# EAGLE schematic EncoderPCB_V1_2 (EAGLE 9.6.2)
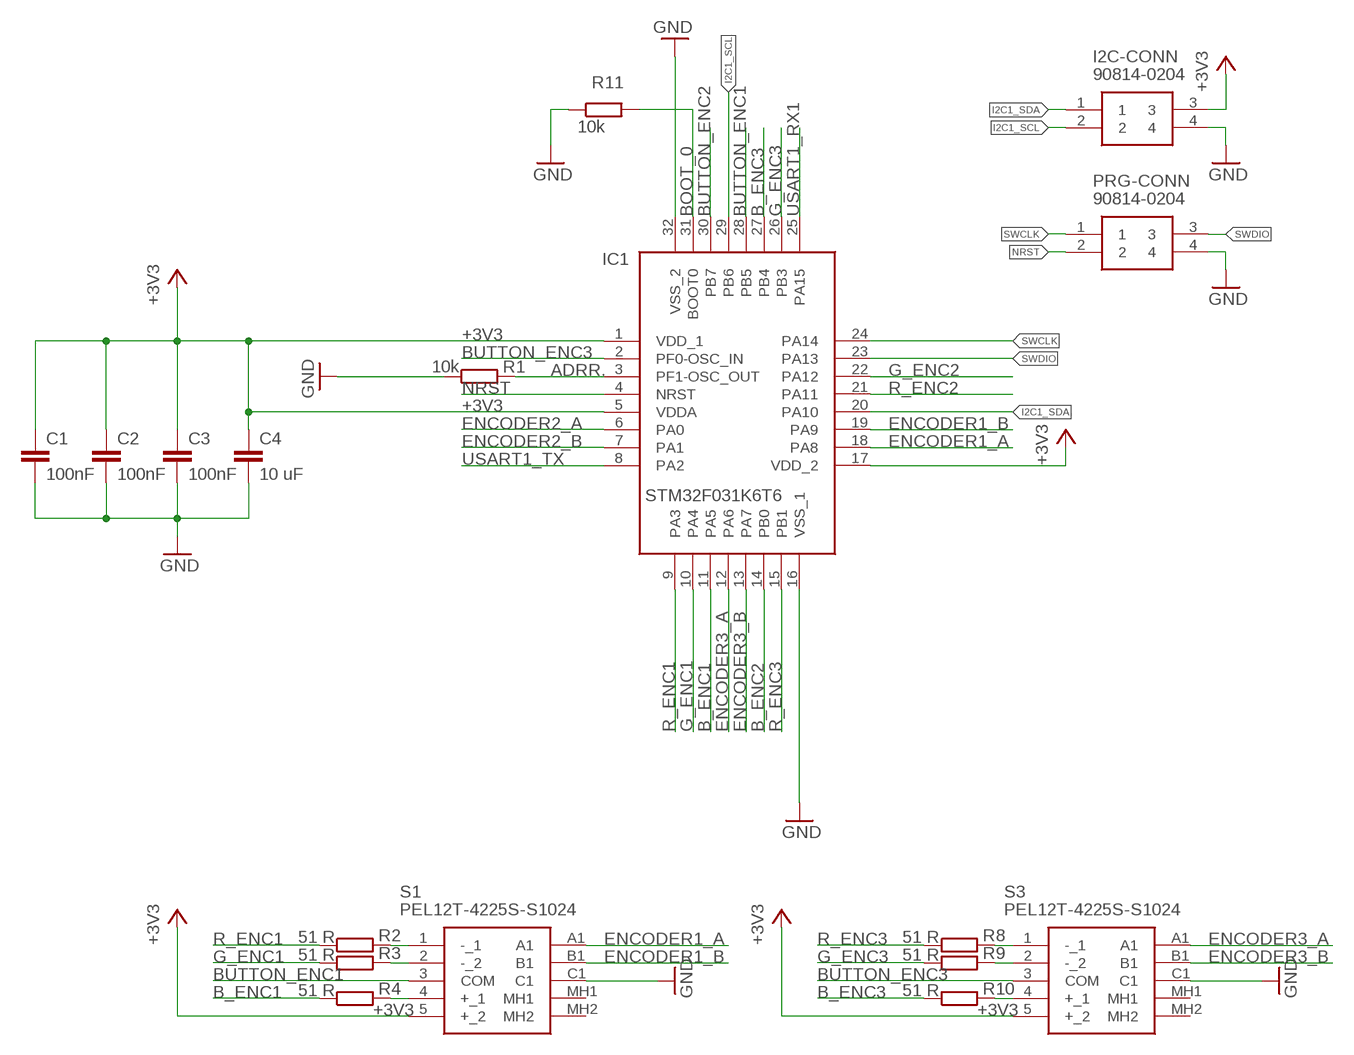
[diagram p0: schematic, sheet 1]

## Parts
C1  100nF  CAPACITOR"  [C0603]
C2  100nF  CAPACITOR"  [C0603]
C3  100nF  CAPACITOR"  [C0603]
C4  10 uF  CAPACITOR_1206  [C1206]
I2C-CONN  90814-0204  [MOLEX_90814-0204]
IC1  STM32F031K6T6  [QFP80P900X900X160-32N]
PRG-CONN  90814-0204  [MOLEX_90814-0204]
R1  10k  RESISTOR_0603  [R0603]
R2  51 R  RESISTOR_0603  [R0603]
R3  51 R  RESISTOR_0603  [R0603]
R4  51 R  RESISTOR_0603  [R0603]
R8  51 R  RESISTOR_0603  [R0603]
R9  51 R  RESISTOR_0603  [R0603]
R10  51 R  RESISTOR_0603  [R0603]
R11  10k  RESISTOR_0603  [R0603]
S1  PEL12T-4225S-S1024  [PEL12T4225SS1024]
S3  PEL12T-4225S-S1024  [PEL12T4225SS1024]

## Nets
+3V3: C1.1 C2.1 C3.1 C4.1 I2C-CONN.3 IC1.1(VDD_1) IC1.5(VDDA) IC1.17(VDD_2) S1.5(+_2) S3.5(+_2)
ADRR.: IC1.3(PF1-OSC_OUT) R1.2
B_ENC1: IC1.11(PA5) R4.1
B_ENC2: IC1.14(PB0)
B_ENC3: IC1.27(PB4) R10.1
BOOT_0: IC1.31(BOOT0) R11.2
BUTTON_ENC1: IC1.28(PB5) S1.3(COM)
BUTTON_ENC2: IC1.30(PB7)
BUTTON_ENC3: IC1.2(PF0-OSC_IN) S3.3(COM)
ENCODER1_A: IC1.18(PA8) S1.A1
ENCODER1_B: IC1.19(PA9) S1.B1
ENCODER2_A: IC1.6(PA0)
ENCODER2_B: IC1.7(PA1)
ENCODER3_A: IC1.12(PA6) S3.A1
ENCODER3_B: IC1.13(PA7) S3.B1
G_ENC1: IC1.10(PA4) R3.1
G_ENC2: IC1.22(PA12)
G_ENC3: IC1.26(PB3) R9.1
GND: C1.2 C2.2 C3.2 C4.2 I2C-CONN.4 IC1.16(VSS_1) IC1.32(VSS_2) PRG-CONN.4 R1.1 R11.1 S1.C1 S3.C1
I2C1_SCL: I2C-CONN.2 IC1.29(PB6)
I2C1_SDA: I2C-CONN.1 IC1.20(PA10)
N$9: R2.2 S1.1(-_1)
N$10: R3.2 S1.2(-_2)
N$12: R4.2 S1.4(+_1)
N$15: R8.2 S3.1(-_1)
N$16: R9.2 S3.2(-_2)
N$17: R10.2 S3.4(+_1)
NRST: IC1.4(NRST) PRG-CONN.2
R_ENC1: IC1.9(PA3) R2.1
R_ENC2: IC1.21(PA11)
R_ENC3: IC1.15(PB1) R8.1
SWCLK: IC1.24(PA14) PRG-CONN.1
SWDIO: IC1.23(PA13) PRG-CONN.3
USART1_RX1: IC1.25(PA15)
USART1_TX: IC1.8(PA2)
Unconnected: S1.MH1 S1.MH2 S3.MH1 S3.MH2

## Library data of the parts
C1-C3 = C_Sager_Bibliothek:CAPACITOR: capacitor
C4 = passive components:CAPACITOR: ceramic capacitor
I2C-CONN PRG-CONN = electro_mechanical:90814-0204: CONN HEADER 4POS 1.27MM SMD TIN Source: Datasheet <https://componentsearchengine.com/Datasheets/1/90814-0204.pdf>; DESCRIPTION: CONN HEADER 4POS 1.27MM SMD TIN; HEIGHT: mm; MANUFACTURER_NAME: Molex; MANUFACTURER_PART_NUMBER: 90814-0204; MOUSER_PART_NUMBER: 538-90814-0204; MOUSER_PRICE-STOCK: https://www.mouser.com/Search/Refine.aspx?Keyword=538-90814-0204
IC1 = C_Sager_Bibliothek:STM32F031K6T6: ARM Microcontrollers - MCU 16/32-BITS MICROS Source: Datasheet <https://componentsearchengine.com/Datasheets/1/STM32F031K6T6.pdf>; DESCRIPTION: ARM Microcontrollers - MCU 16/32-BITS MICROS; HEIGHT: 1.6mm; MANUFACTURER_NAME: STMicroelectronics; MANUFACTURER_PART_NUMBER: STM32F031K6T6; MOUSER_PART_NUMBER: 511-STM32F031K6T6; MOUSER_PRICE-STOCK: https://www.mouser.com/Search/Refine.aspx?Keyword=511-STM32F031K6T6
R1-R4 R8-R11 = passive components:RESISTOR: +/- 5 % resistor
S1 S3 = electro_mechanical:PEL12T-4225S-S1024: Encoders Red Blue/Green LED Push Switch Knurled Source: Datasheet <https://componentsearchengine.com/Datasheets/1/PEL12T-4225S-S1024.pdf>; DESCRIPTION: Encoders Red Blue/Green LED Push Switch Knurled; HEIGHT: 25mm; MANUFACTURER_NAME: Bourns; MANUFACTURER_PART_NUMBER: PEL12T-4225S-S1024; MOUSER_PART_NUMBER: 652-PEL12T4225SS1024; MOUSER_PRICE-STOCK: https://www.mouser.com/Search/Refine.aspx?Keyword=652-PEL12T4225SS1024